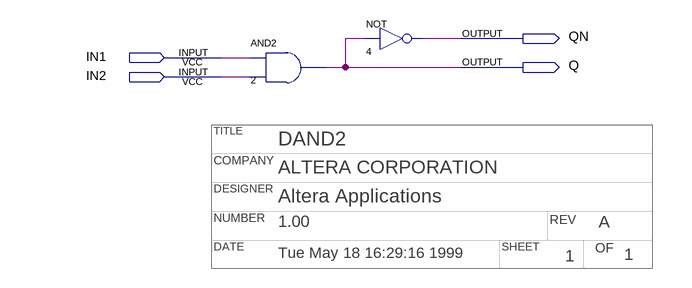
[diagram p0: schematic sheet]
// Quartus schematic dand2.bdf as structural Verilog: 2 symbols, 4 pins
// Title block: TITLE: DAND2; COMPANY: ALTERA CORPORATION; DESIGNER: Altera Applications; NUMBER: 1.00; REV: A; DATE: Tue May 18 16:29:16 1999; SHEET: 1; OF: 1
module dand2 (
  input  IN1,
  input  IN2,
  output QN,
  output Q
);

  and u_2 (Q, IN1, IN2);
  not u_4 (QN, Q);
endmodule
